# EasyEDA schematic schematic.json
TITLE: 7.3D Schematic; REV: 1.0; Date: 2022-05-25; Sheet: 1/1; Drawn By: 218361724; Company: SIT210
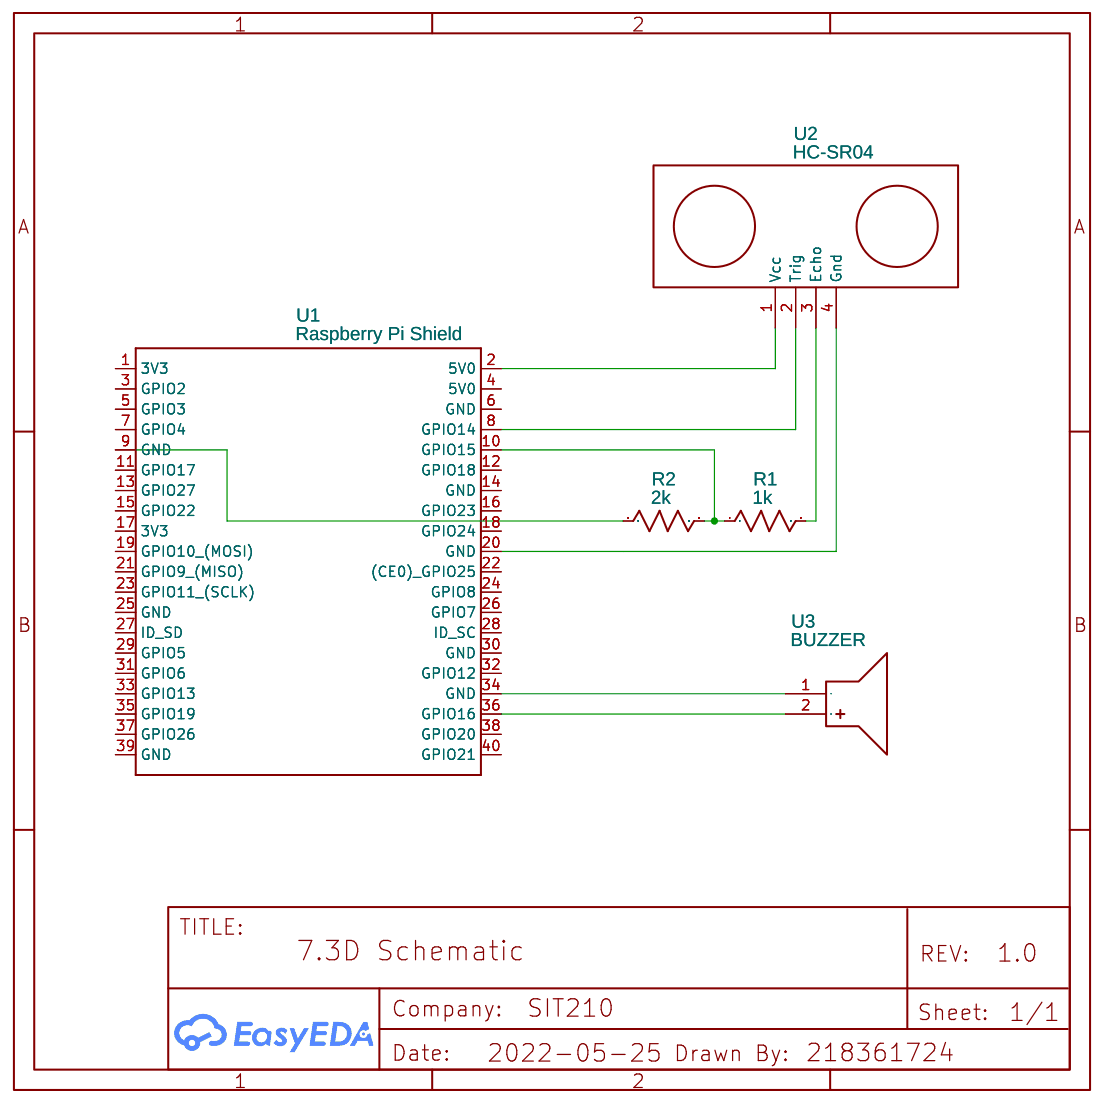
[diagram p0: schematic sheet]

## Parts
R1  1k  [R0603]
R2  2k  [R0603]
U1  Raspberry Pi Shield  [RASBERRYPI-3-HAT]
U2  HC-SR04  [HC-SR04]
U3  BUZZER  [BUZ-TH_BD12.0-P6.00-D0.9-RD]

## Library data of the parts
R1 R2 = R_0603_US: Contributor: LCEDA_Lib
U1 = RaspberryPi 3 Hat: Manufacturer Part: RaspberryPi 3; Contributor: lynxlabeling
U2 = HC-SR04 COPY: Contributor: Slowhand
U3 = BUZZER: Supplier: LCSC; Supplier Part: C9900014030; Manufacturer: null; Manufacturer Part: buzzer; JLCPCB Part Class: Extended Part; Contributor: lcsc

## Nets
Net-(R1-1): R1.1 R2.2 U1.10(GPIO15)
Net-(R1-2): R1.2 U2.3(Echo)
Net-(R2-1): R2.1 U1.9(GND)
Net-(U1-2): U1.2(5V0) U2.1(Vcc)
Net-(U1-8): U1.8(GPIO14) U2.2(Trig)
Net-(U1-20): U1.20(GND) U2.4(Gnd)
Net-(U1-34): U1.34(GND) U3.1(-)
Net-(U1-36): U1.36(GPIO16) U3.2(+)

Not connected (* = marked no-connect by the designer): U1 1(3V3) 3(GPIO2) 4(5V0) 5(GPIO3) 6(GND) 7(GPIO4) 11(GPIO17) 12(GPIO18) 13(GPIO27) 14(GND) 15(GPIO22) 16(GPIO23) 17(3V3) 18(GPIO24) 19(GPIO10 (MOSI)) 21(GPIO9 (MISO)) 22((CE0) GPIO25) 23(GPIO11 (SCLK)) 24(GPIO8) 25(GND) 26(GPIO7) 27(ID_SD) 28(ID_SC) 29(GPIO5) 30(GND) 31(GPIO6) 32(GPIO12) 33(GPIO13) 35(GPIO19) 37(GPIO26) 38(GPIO20) 39(GND) 40(GPIO21)
